# Altium schematic sheet BSPD_General_SCH.SchDoc: BPSD- Comparadores
size A4; Author: FASE MotorSport UTN; Revision: 1.0; SheetNumber: 2; SheetTotal: 3
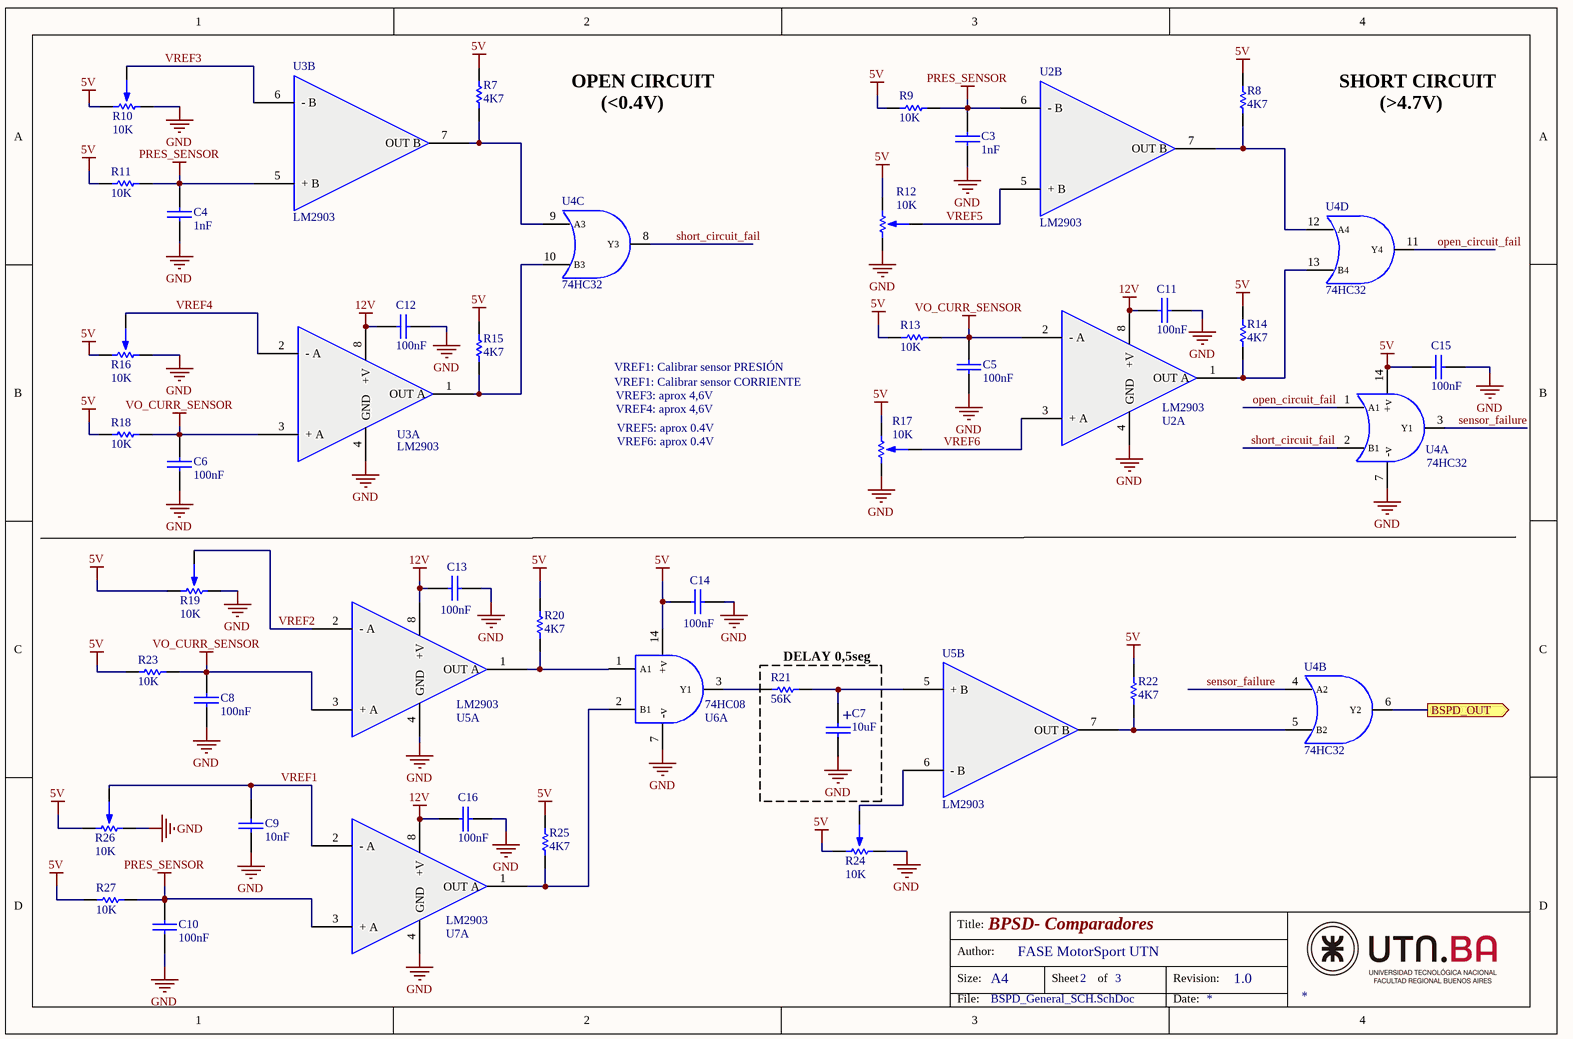
[diagram p0: BSPD_General_SCH.SchDoc]

## Parts
C3  1nF  [CAP200]
C4  1nF  [CAP200]
C5  100nF  [CAP200]
C6  100nF  [CAP200]
C7  10uF  [CAP100RP]
C8  100nF  [CAP200]
C9  10nF  [CAP200]
C10  100nF  [CAP200]
C11  100nF  [CAP200]
C12  100nF  [CAP200]
C13  100nF  [CAP200]
C14  100nF  [CAP200]
C15  100nF  [CAP200]
C16  100nF  [CAP200]
R7  4K7  [RES400]
R8  4K7  [RES400]
R9  10K  [RES400]
R10  10K  [PRESET V]
R11  10K  [RES400]
R12  10K  [PRESET V]
R13  10K  [RES400]
R14  4K7  [RES400]
R15  4K7  [RES400]
R16  10K  [PRESET V]
R17  10K  [PRESET V]
R18  10K  [RES400]
R19  10K  [PRESET V]
R20  4K7  [RES400]
R21  56K  [RES400]
R22  4K7  [RES400]
R23  10K  [RES400]
R24  10K  [PRESET V]
R25  4K7  [RES400]
R26  10K  [PRESET V]
R27  10K  [RES400]
U2  LM2903  [DIP8]  (parts A,B of 2)
U3  LM2903  [DIP8]  (parts A,B of 2)
U4  74HC32  [DIP14]  (parts A,B,C,D of 4)
U5  LM2903  [DIP8]  (parts A,B of 2)
U6  74HC08  [DIP14]  (part A of 4)
U7  LM2903  [DIP8]  (part A of 2)

## Ports
BSPD_OUT (out)

## Nets
5V: C14.1 C15.1 R7.2 R8.2 R9.1 R10.1 R11.1 R12.1 R13.1 R14.2 R15.2 R16.1 R17.1 R18.1 R19.1 R20.2 R22.2 R23.1 R24.1 R25.2 R26.1 R27.1 U4.14(+v) U6.14(+v)
12V: C11.1 C12.1 C13.1 C16.1 U2.8(+V) U3.8(+V) U5.8(+V) U7.8(+V)
GND: C3.2 C4.2 C5.2 C6.2 C7.2 C8.2 C9.2 C10.2 C11.2 C12.2 C13.2 C14.2 C15.2 C16.2 R10.3 R12.3 R16.3 R17.3 R19.3 R24.3 R26.3 U2.4(GND) U3.4(GND) U4.7(-v) U5.4(GND) U6.7(-v) U7.4(GND)
PRES_SENSOR: C3.1 C4.1 C10.1 R9.2 R11.2 R27.2 U2.6(-_B) U3.5(+_B) U7.3(+_A)
VO_CURR_SENSOR: C5.1 C6.1 C8.1 R13.2 R18.2 R23.2 U2.2(-_A) U3.3(+_A) U5.3(+_A)
BSPD_OUT: U4.6(Y2) ; port BSPD_OUT
open_circuit_fail: U4.1(A1) U4.11(Y4)
sensor_failure: U4.3(Y1) U4.4(A2)
short_circuit_fail: U4.2(B1) U4.8(Y3)
VREF1: C9.1 R26.2 U7.2(-_A)
VREF2: R19.2 U5.2(-_A)
VREF3: R10.2 U3.6(-_B)
VREF4: R16.2 U3.2(-_A)
VREF5: R12.2 U2.5(+_B)
VREF6: R17.2 U2.3(+_A)
NetC7_1: C7.1 R21.2 U5.5(+_B)
NetR7_1: R7.1 U3.7(OUT_B) U4.9(A3)
NetR8_1: R8.1 U2.7(OUT_B) U4.12(A4)
NetR14_1: R14.1 U2.1(OUT_A) U4.13(B4)
NetR15_1: R15.1 U3.1(OUT_A) U4.10(B3)
NetR20_1: R20.1 U5.1(OUT_A) U6.1(A1)
NetR21_1: R21.1 U6.3(Y1)
NetR22_1: R22.1 U4.5(B2) U5.7(OUT_B)
NetR24_2: R24.2 U5.6(-_B)
NetR25_1: R25.1 U6.2(B1) U7.1(OUT_A)

## Notes on the sheet
- OPEN CIRCUIT
- (<0.4V)
- SHORT CIRCUIT
- (>4.7V)
- VREF1: Calibrar sensor PRESIÓN
- VREF1: Calibrar sensor CORRIENTE
- VREF3: aprox 4,6V
- VREF4: aprox 4,6V
- VREF5: aprox 0.4V
- VREF6: aprox 0.4V
- (near R21) DELAY 0,5seg
- Title:
- Size:
- Author:
- A4
- Sheet
- of
- Revision:
- File:
- Date:
- (in symbol CAPPOL) +

## Library data of the parts
C3-C6 C8-C16 = CAP
C7 = CAPPOL
R7-R9 R11 R13-R15 R18 R20-R23 R25 R27 = RES
R10 R12 R16 R17 R19 R24 R26 = PRESET
U2 U3 U5 U7 = LM2903: Comparador
U4 = 74HC32: Compuerta OR; Autor: SALERNO, Santiago; fecha: 10/05/2019; datasheet: https://cdn.datasheetspdf.com/pdf-down/7/4/H/74HC14-ONSemiconductor.pdf
U6 = 74HC08: Compuerta AND; Autor: SALERNO, Santiago; fecha: 10/05/2019; datasheet: https://cdn.datasheetspdf.com/pdf-down/7/4/H/74HC14-ONSemiconductor.pdf